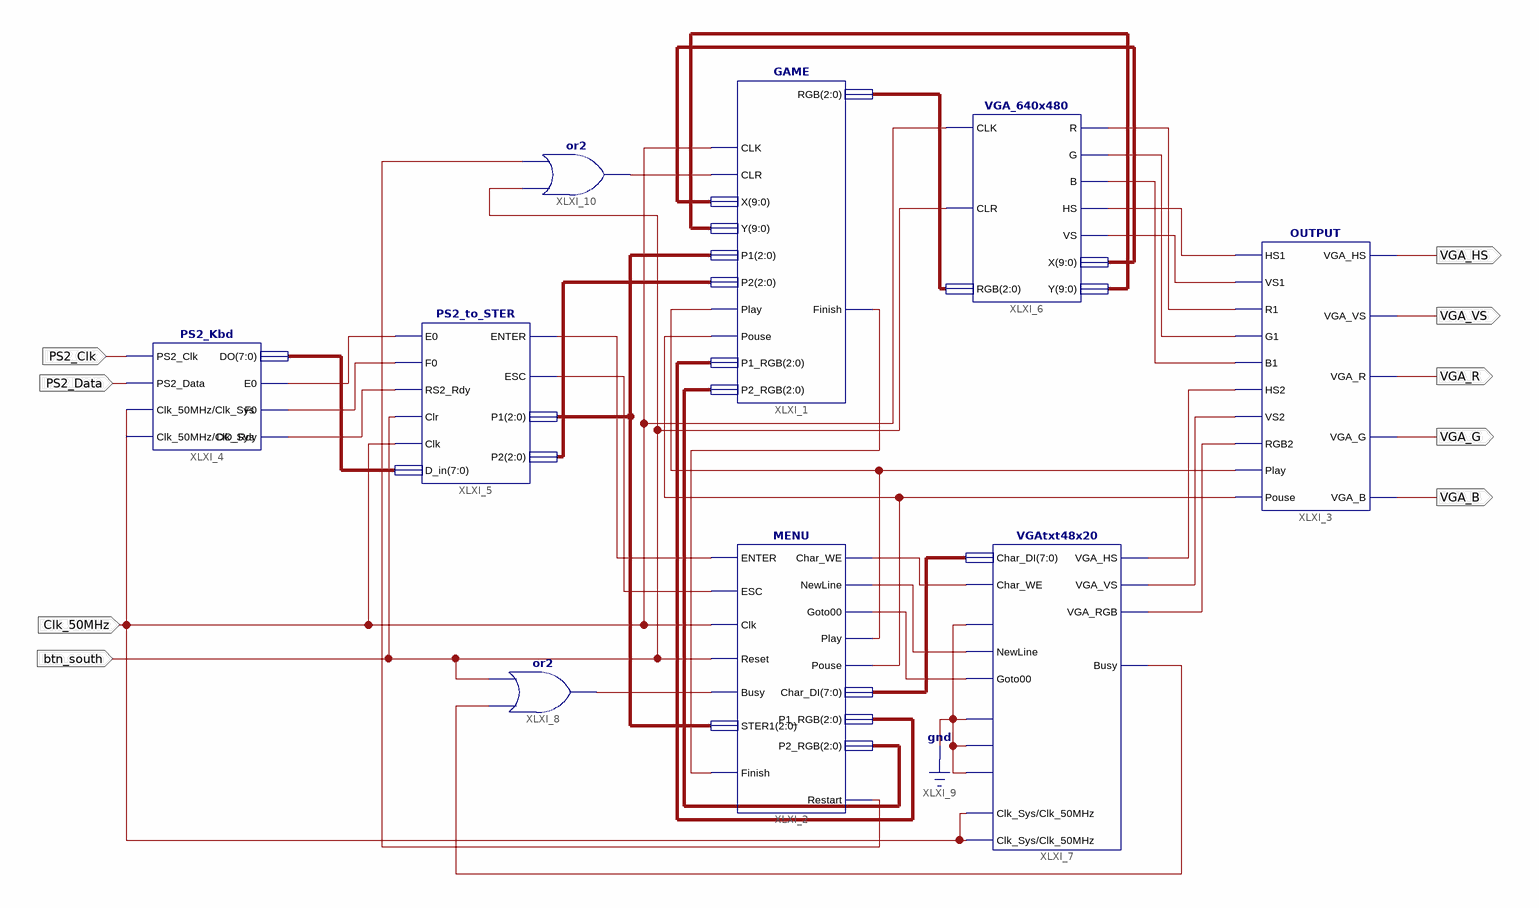
[diagram p0: schematic sheet 1]
// Xilinx ISE schematic main.sch (spartan3e) as structural Verilog: 9 symbols, 9 ports
module main (
  input  PS2_Clk,
  input  PS2_Data,
  input  Clk_50MHz,
  input  btn_south,
  output VGA_HS,
  output VGA_VS,
  output VGA_R,
  output VGA_G,
  output VGA_B
);

  wire XLXN_2, XLXN_3, XLXN_4, XLXN_6, XLXN_7, XLXN_8, XLXN_9, XLXN_10, XLXN_18, XLXN_20, XLXN_24, XLXN_25,
       XLXN_26, XLXN_49, XLXN_51, XLXN_60, XLXN_61, XLXN_64, XLXN_75, XLXN_82, XLXN_84, XLXN_85, XLXN_91;
  wire [2:0] XLXN_5, XLXN_28, XLXN_30, XLXN_62, XLXN_63;
  wire [7:0] XLXN_1, XLXN_21;
  wire [9:0] XLXN_39, XLXN_92;

  GAME XLXI_1 (
    .CLK(Clk_50MHz), .CLR(XLXN_91), .Play(XLXN_60), .Pouse(XLXN_61), .X(XLXN_92), .Y(XLXN_39), .P1(XLXN_28),
    .P2(XLXN_30), .P1_RGB(XLXN_62), .P2_RGB(XLXN_63), .Finish(XLXN_75), .RGB(XLXN_5));
  MENU XLXI_2 (
    .ENTER(XLXN_84), .ESC(XLXN_18), .Clk(Clk_50MHz), .Reset(btn_south), .Busy(XLXN_49), .Finish(XLXN_75),
    .STER1(XLXN_28), .Char_WE(XLXN_20), .NewLine(XLXN_64), .Goto00(XLXN_82), .Play(XLXN_60), .Pouse(XLXN_61),
    .Restart(XLXN_85), .Char_DI(XLXN_21), .P1_RGB(XLXN_62), .P2_RGB(XLXN_63));
  OUTPUT XLXI_3 (
    .HS1(XLXN_6), .VS1(XLXN_7), .R1(XLXN_8), .G1(XLXN_9), .B1(XLXN_10), .HS2(XLXN_24), .VS2(XLXN_25),
    .RGB2(XLXN_26), .Play(XLXN_60), .Pouse(XLXN_61), .VGA_HS(VGA_HS), .VGA_VS(VGA_VS), .VGA_R(VGA_R),
    .VGA_G(VGA_G), .VGA_B(VGA_B));
  PS2_Kbd XLXI_4 (
    .PS2_Clk(PS2_Clk), .PS2_Data(PS2_Data), .Clk_50MHz(Clk_50MHz), .E0(XLXN_2), .F0(XLXN_3), .DO_Rdy(XLXN_4),
    .DO(XLXN_1), .Clk_Sys(Clk_50MHz));
  PS2_to_STER XLXI_5 (
    .E0(XLXN_2), .F0(XLXN_3), .RS2_Rdy(XLXN_4), .Clr(btn_south), .Clk(Clk_50MHz), .D_in(XLXN_1),
    .ENTER(XLXN_84), .ESC(XLXN_18), .P1(XLXN_28), .P2(XLXN_30));
  VGA_640x480 XLXI_6 (
    .CLK(Clk_50MHz), .CLR(btn_south), .RGB(XLXN_5), .R(XLXN_8), .G(XLXN_9), .B(XLXN_10), .HS(XLXN_6),
    .VS(XLXN_7), .X(XLXN_92), .Y(XLXN_39));
  VGAtxt48x20 XLXI_7 (
    .Char_DI(XLXN_21), .Home(1'b0), .NewLine(XLXN_64), .Goto00(XLXN_82), .Clk_Sys(Clk_50MHz),
    .Clk_50MHz(Clk_50MHz), .CursorOn(1'b0), .ScrollEn(1'b0), .ScrollClear(1'b0), .Busy(XLXN_51),
    .VGA_HS(XLXN_24), .VGA_VS(XLXN_25), .VGA_RGB(XLXN_26), .Char_WE(XLXN_20));
  or XLXI_8 (XLXN_49, XLXN_51, btn_south);
  or XLXI_10 (XLXN_91, btn_south, XLXN_85);
endmodule
